# Altium schematic sheet amp-27dBm.SchDoc: RF Amp (27dBm)
size Letter; CheckedBy: J. Brinton; CompanyName: Signal Laboratories, Inc.; DrawnBy: J. Brinton; Engineer: J. Brinton; Address1: 3479 Edison Way; Address2: Menlo Park CA 94025; Address3: +1 (877) 778-8435; Address4: siglabs.com; Revision: 3; SheetNumber: 8; SheetTotal: 49
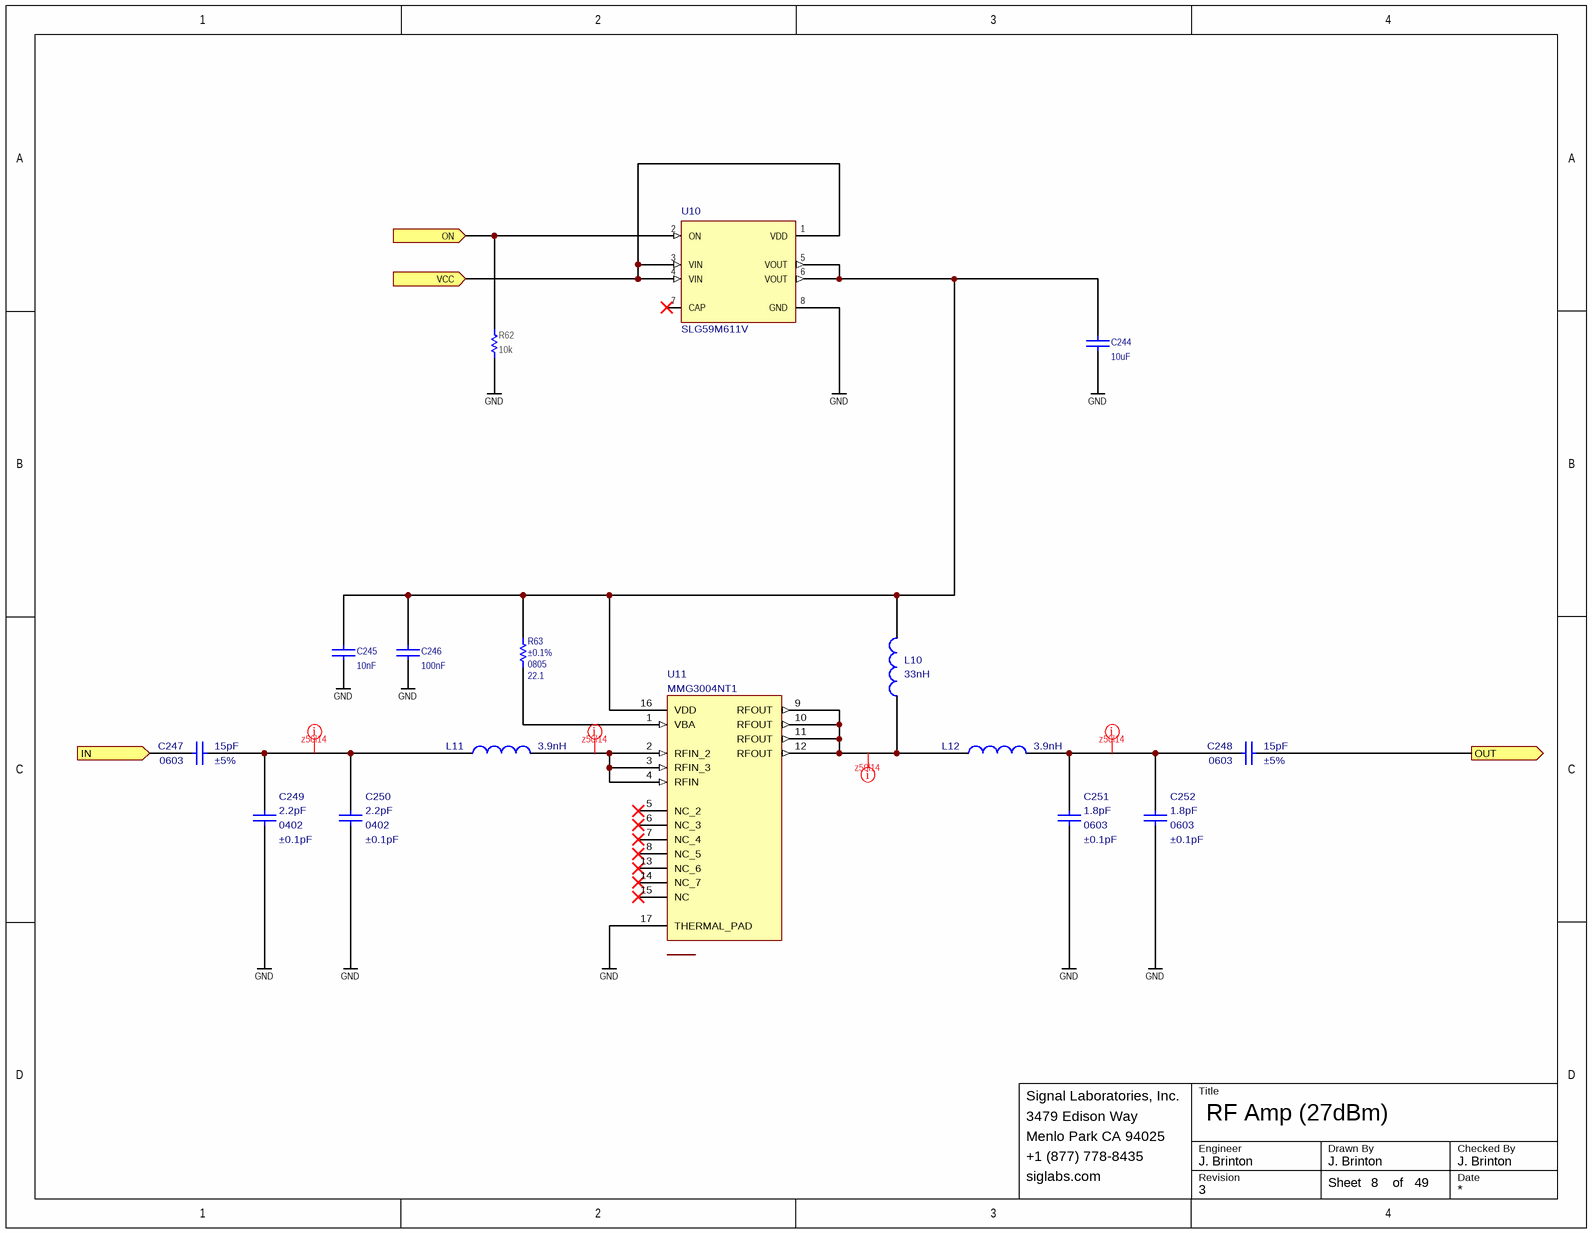
[diagram p0: amp-27dBm.SchDoc]

## Parts
C244  value 10uF  [CAPC160X80X90L20N]  (hidden comment: ZRB18AR61E106ME01L)
C245  value 10nF  [CAPC100X50X55L25N]  (hidden comment: GRM155R71H103KA88)
C246  value 100nF  [CAPC100X50X55L25N]  (hidden comment: GRM155R71C104KA88J)
C247  value 15pF  Tolerance: ±5%  Package: 0603  [CAPC160X80X90L20N]  (hidden comment: GQM1885C1H150JB01D)
C248  value 15pF  Tolerance: ±5%  Package: 0603  [CAPC160X80X90L20N]  (hidden comment: GQM1885C1H150JB01D)
C249  value 2.2pF  Tolerance: ±0.1pF  Package: 0402  [CAPC100X50X55L25N]  (hidden comment: VJ0402A2R2BXA)
C250  value 2.2pF  Tolerance: ±0.1pF  Package: 0402  [CAPC100X50X55L25N]  (hidden comment: VJ0402A2R2BXA)
C251  value 1.8pF  Tolerance: ±0.1pF  Package: 0603  [CAPC160X80X90L20N]  (hidden comment: 06032U1R8BAT2A)
C252  value 1.8pF  Tolerance: ±0.1pF  Package: 0603  [CAPC160X80X90L20N]  (hidden comment: 06032U1R8BAT2A)
L10  value 33nH  [INDC2520X100N]  (hidden comment: 744762133A)
L11  value 3.9nH  [0603]  (hidden comment: 744761039C)
L12  value 3.9nH  [0603]  (hidden comment: 744761039C)
R62  value 10k  [RESC1005X40N]  (hidden comment: ERJ-2RKF1002X)
R63  value 22.1  Tolerance: ±0.1%  Package: 0805  [RESC2012X70N]  (hidden comment: PTN0805E22R1BST1)
U10  SLG59M611V  [DFN200X150X80-8N]
U11  MMG3004NT1  [QFN65P400X400X90-17N]

## Ports
IN (in), ON (in), OUT (out), VCC (in)

## Nets
GND: C244.1 C245.1 C246.1 C249.1 C250.1 C251.1 C252.1 R62.1 U10.8(GND) U11.17(THERMAL_PAD)
IN: C247.1 ; port IN
ON: R62.2 U10.2(ON) ; port ON
OUT: C248.2 ; port OUT
VCC: U10.1(VDD) U10.3(VIN) U10.4(VIN) ; port VCC
NetC244_2: C244.2 C245.2 C246.2 L10.2 R63.1 U10.5(VOUT) U10.6(VOUT) U11.16(VDD)
NetC247_2: C247.2 C249.2 C250.2 L11.1
NetC248_1: C248.1 C251.2 C252.2 L12.2
NetL10_1: L10.1 L12.1 U11.9(RFOUT) U11.10(RFOUT) U11.11(RFOUT) U11.12(RFOUT)
NetL11_2: L11.2 U11.2(RFIN_2) U11.3(RFIN_3) U11.4(RFIN)
NetR63_2: R63.2 U11.1(VBA)

Not connected (* = marked no-connect by the designer): U10 7(CAP)*; U11 5(NC_2)* 6(NC_3)* 7(NC_4)* 8(NC_5)* 13(NC_6)* 14(NC_7)* 15(NC)*

## Layout directives
net class z50l14: NetC247_2, NetC248_1, NetL10_1, NetL11_2

## Notes on the sheet
- Title
- Engineer
- Revision
- Drawn By
- Checked By
- Date
- Sheet
- of

## Library data of the parts
C244 = CAP 0603: Ceramic Capacitor 10uF ±20% 25V X5R 0603; Manufacturer: Murata; Tr: -55:85; Manufacturer P/N: ZRB18AR61E106ME01L; Voltage: 25V; Package: 0603; Tolerance: ±20%
C245 = CAP 0402: Ceramic Capacitor 10nF ±10% 50V X7R 0402; Manufacturer: Murata; Tr: -55:125; Voltage: 50V; Manufacturer P/N: GRM155R71H103KA88; Package: 0402; Tolerance: ±10%
C246 = CAP 0402: Ceramic Capacitor 100nF ±10% 16V X7R 0402; Manufacturer: Murata; Tr: -55:125; Voltage: 16V; Manufacturer P/N: GRM155R71C104KA88J; Package: 0402; Tolerance: ±10%
C247 C248 = CAP: Ceramic Capacitor 15pF ±5% NP0 0603; Manufacturer: Murata; Voltage: 50V; Tr: -55"125; Manufacturer P/N: GQM1885C1H150JB01D
C249 C250 = CAP: Ceramic Capacitor 2.2pF ±0.1pF 50V C0G 0402; Manufacturer: Vishay; Tr: -55"125; Manufacturer P/N: VJ0402A2R2BXA; Voltage: 50V
C251 C252 = CAP: Ceramic Capacitor 1.8pF ±0.1pF NP0 0603; Manufacturer: AVX; Voltage: 200V; Tr: -55"125; Manufacturer P/N: 06032U1R8BAT2A
L10 = INDUCTOR: Inductor 33nH 1A; Manufacturer: Wurth Electronics; Manufacturer P/N: 744762133A
L11 L12 = INDUCTOR: Inductor 3.9nH 700mA 0603; Manufacturer: Wurth Electronics; Manufacturer P/N: 744761039C; package: 0603
R62 = RES: Thick Film Resistor 10k ±1% 0.1W 50V 0402; Manufacturer: Panasonic; Tcr: ±100; Tr: -55:155; Voltage: 50; Power: 0.1; Manufacturer P/N: ERJ-2RKF1002X; Tolerance: ±1%; Alternatives: *; Footprint: *; Package: 0402
R63 = RES: Thin Film Resistor 22.1 +/-0.1% SMD 0805; Manufacturer: Vishay; Tr: -55:155; Tcr: *; Manufacturer P/N: PTN0805E22R1BST1; Alternatives: *; Voltage: *; Power: *
U10 = SLG59M611V: High-Side Load Switch; Manufacturer: Silego; Package: WFDFN-8 Silego; Manufacturer P/N: SLG59M611V
U11 = MMG3006NT1: RF Amp Chip Single GP 2.4GHz 6V 16-Pin QFN EP T/R; Manufacturer: NXP Semiconductors; Package: QFN-16 NXP Semiconductors; Value: *; Manufacturer P/N: MMG3006NT1